# Altium project BOTTOM_BOARD.PrjPCB
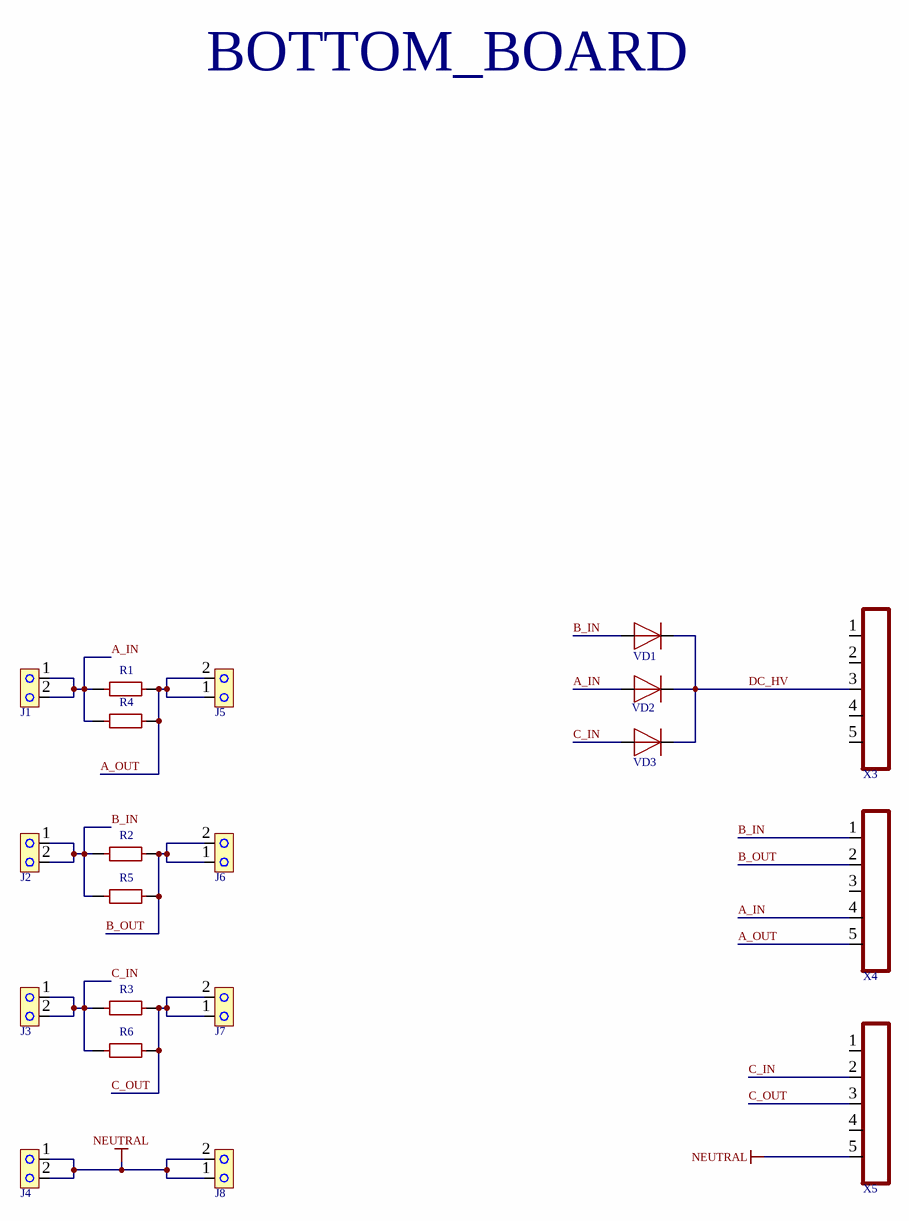
[diagram p0: BOTTOM_BOARD.SchDoc]
1 sheet, 20 parts. Net scope: global (net labels, ports and power ports of the same name join across sheets).
Board file: BOTTOM_BOARD.PcbDoc

## Sheet BOTTOM_BOARD.SchDoc
size A1

### Parts
J1  TL-800  [Conn_Tianli_T-800]  (value not drawn)
J2  TL-800  [Conn_Tianli_T-800]  (value not drawn)
J3  TL-800  [Conn_Tianli_T-800]  (value not drawn)
J4  TL-800  [Conn_Tianli_T-800]  (value not drawn)
J5  TL-800  [Conn_Tianli_T-800]  (value not drawn)
J6  TL-800  [Conn_Tianli_T-800]  (value not drawn)
J7  TL-800  [Conn_Tianli_T-800]  (value not drawn)
J8  TL-800  [Conn_Tianli_T-800]  (value not drawn)
R1  RES-CONST  [RES-3921]  (value not drawn)
R2  RES-CONST  [RES-3921]  (value not drawn)
R3  RES-CONST  [RES-3921]  (value not drawn)
R4  RES-CONST  [RES-3921]  (value not drawn)
R5  RES-CONST  [RES-3921]  (value not drawn)
R6  RES-CONST  [RES-3921]  (value not drawn)
VD1  DIODE  [DO-214BA]  (value not drawn)
VD2  DIODE  [DO-214BA]  (value not drawn)
VD3  DIODE  [DO-214BA]  (value not drawn)
X3  CONN-5-PIN  [CONN-PLS-5-2.54mm]  (value not drawn)
X4  CONN-5-PIN  [CONN-PLS-5-2.54mm]  (value not drawn)
X5  CONN-5-PIN  [CONN-PLS-5-2.54mm]  (value not drawn)

### Nets
NEUTRAL: J4.1 J4.2 J8.1 J8.2 X5.5
A_IN: J1.1 J1.2 R1.1 R4.1 VD2.2(A) X4.4
A_OUT: J5.1 J5.2 R1.2 R4.2 X4.5
B_IN: J2.1 J2.2 R2.1 R5.1 VD1.2(A) X4.1
B_OUT: J6.1 J6.2 R2.2 R5.2 X4.2
C_IN: J3.1 J3.2 R3.1 R6.1 VD3.2(A) X5.2
C_OUT: J7.1 J7.2 R3.2 R6.2 X5.3
DC_HV: VD1.1(C) VD2.1(C) VD3.1(C) X3.3

Not connected (* = marked no-connect by the designer): X3 1 2 4 5; X4 3; X5 1 4

### Notes on the sheet
- BOTTOM_BOARD

### Library data of the parts
J1-J8 = Connector_Tianli_T-800